# EasyEDA Pro project ProPrj_PCB_2025-05-19.epro, schematic Schematic3
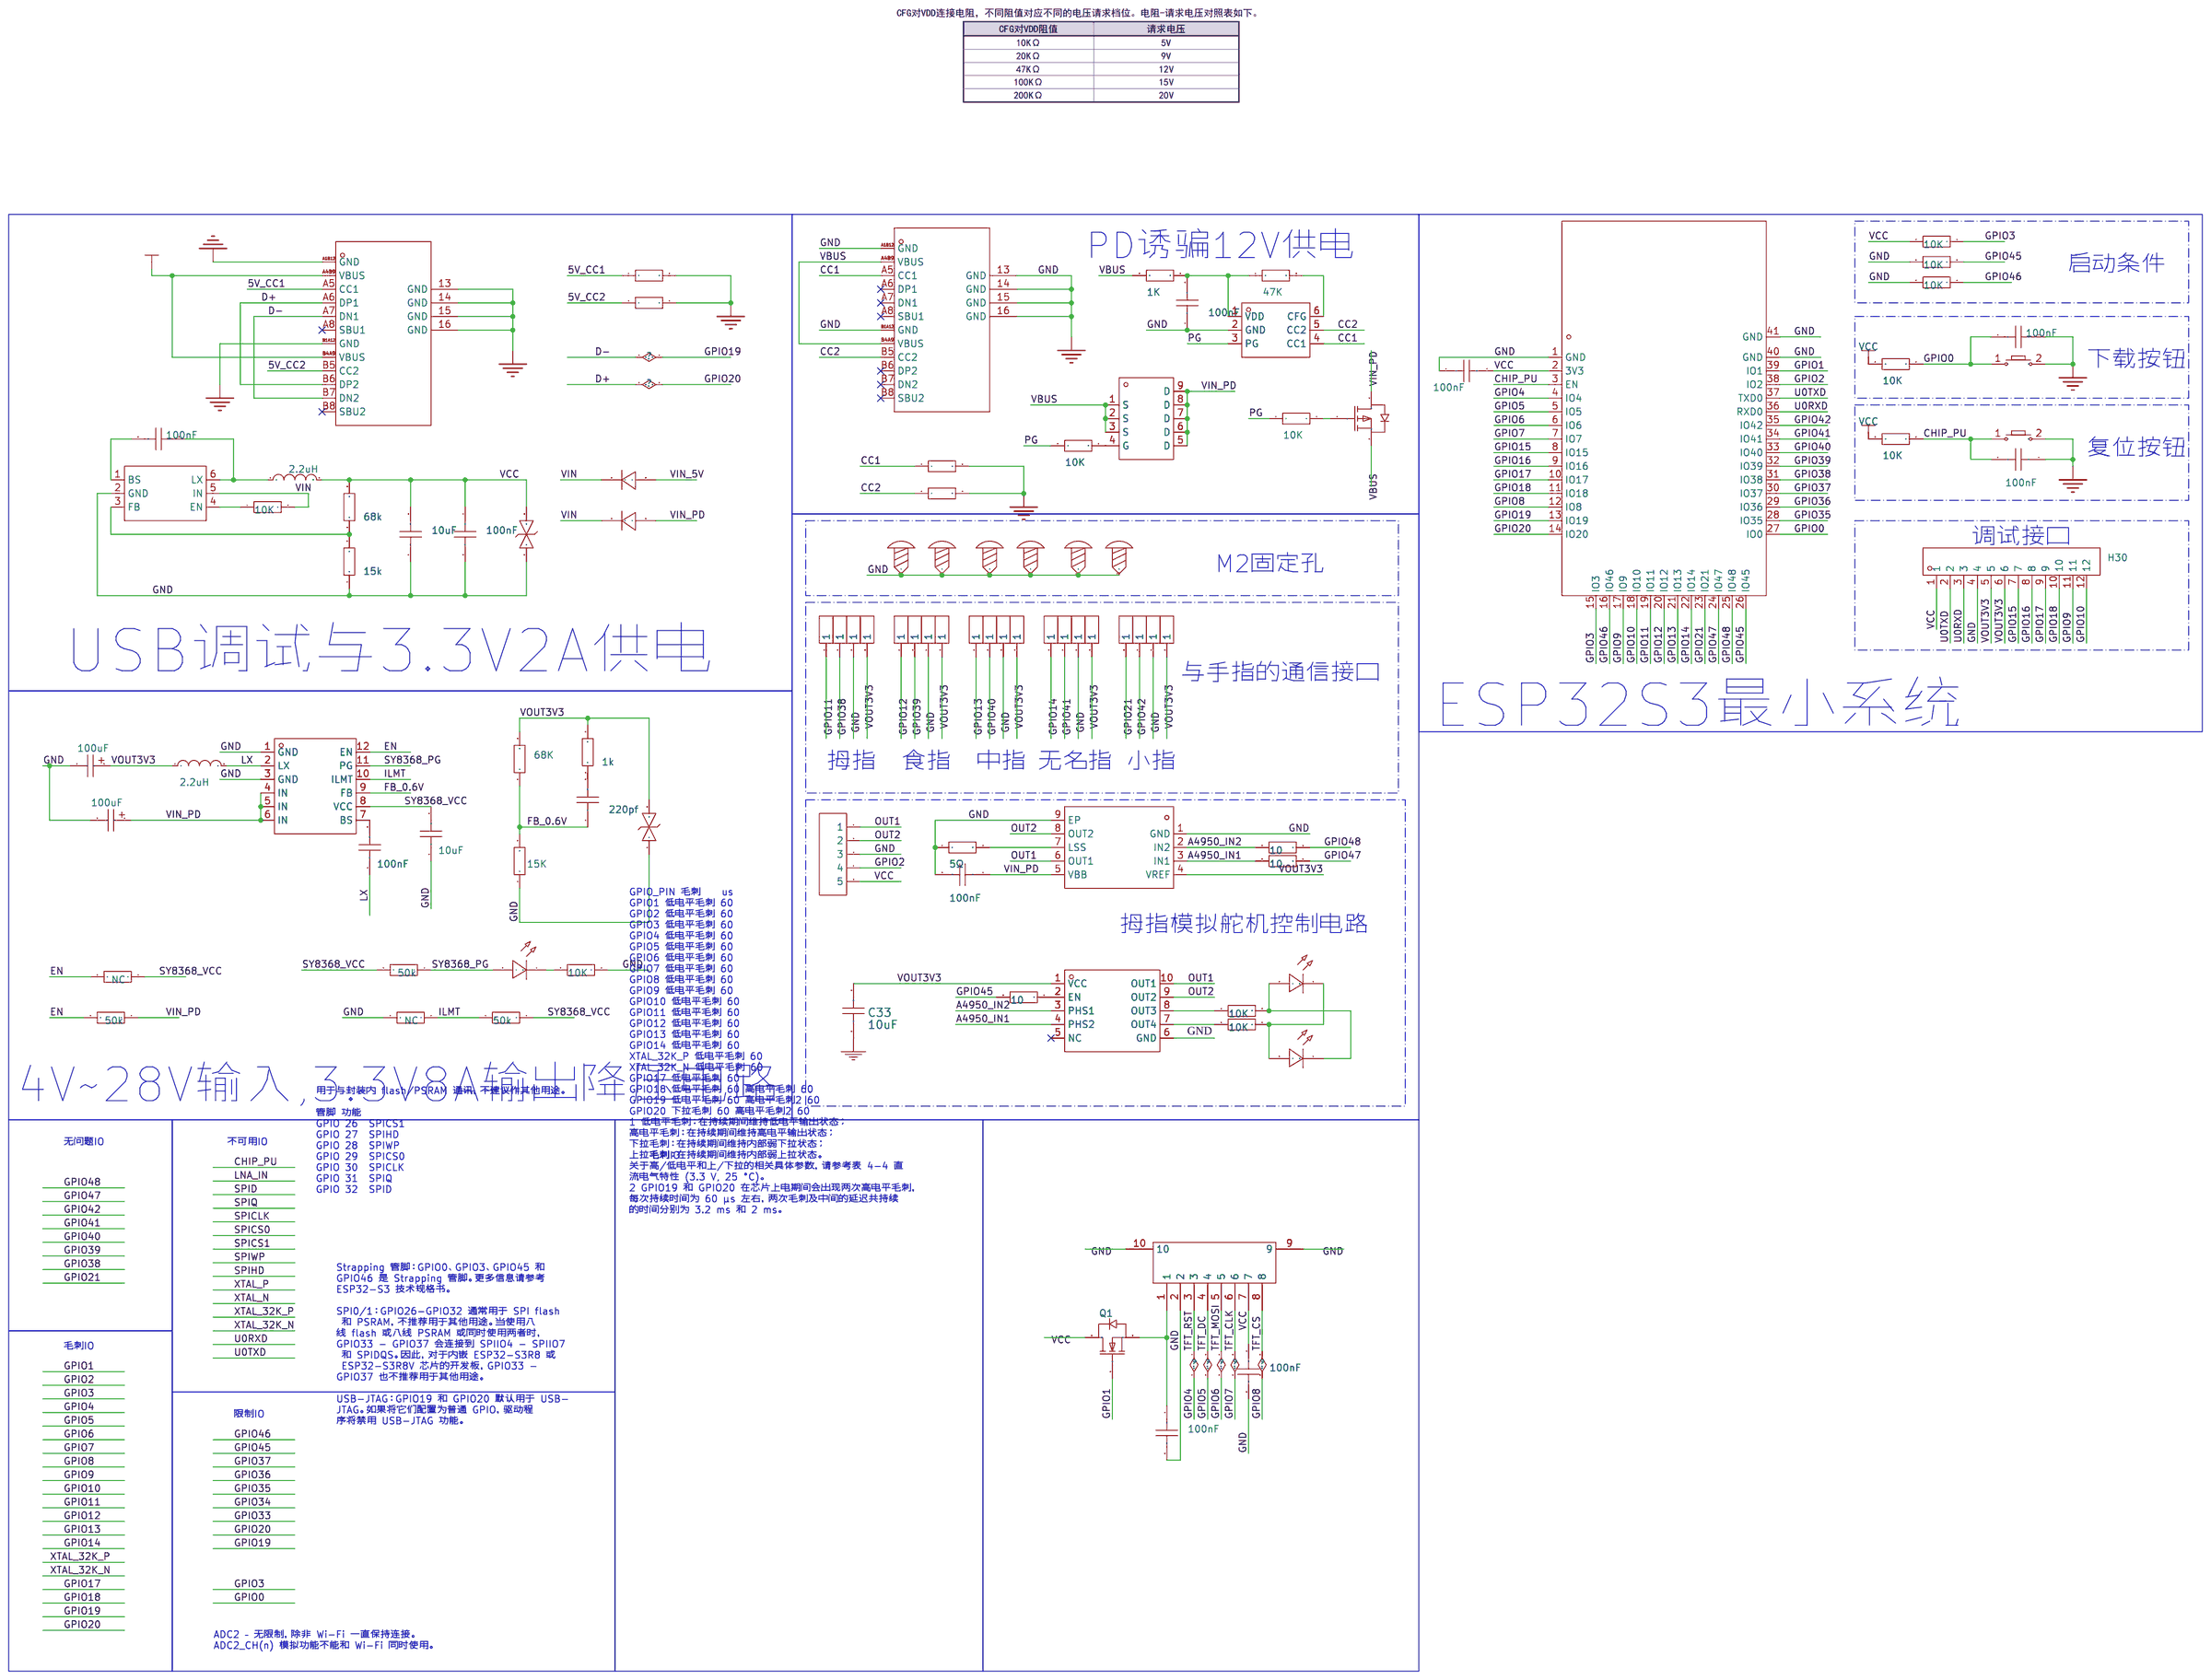
[diagram p1: schematic sheet]

## Parts
C1  100nF  [C0603]
C5  220pf  [C0603]
C6  100nF  [C0603]
C7  100nF  [C0603]
C9  100nF  [C0603]
C10  100nF  [C0603]
C11  100nF  [C0603]
C24  100nF  [C0603]
C25  100nF  [C0603]
C26  100nF  [C0603]
C27  10uF  [C0603]
C28  100nF  [C0603]
C29  10uF  [C0603]
C31  100uF  [CASE-B_3528]
C32  100uF  [CASE-B_3528]
C33  10uF  [C0603]
D1  SMBJ33CA  [SMB_L4.6-W3.6-LS5.4-BI]
D2  SMBJ33CA  [SMB_L4.6-W3.6-LS5.4-BI]
D3  S10MC  [SMC_L7.1-W6.2-LS8.1-RD]
D4  S10MC  [SMC_L7.1-W6.2-LS8.1-RD]
FPC1  AFC01-S08FCA-00  [FPC-SMD_P0.50-8P_FGS-XJ-H2.0]
H6  -  [HDR-TH_5P-P2.54-V-F]
H10  -  [HDR-TH_1P-V-M_XKB_X4611WV-01I-C28D40]
H11  -  [HDR-TH_1P-V-M_XKB_X4611WV-01I-C28D40]
H12  -  [HDR-TH_1P-V-M_XKB_X4611WV-01I-C28D40]
H13  -  [HDR-TH_1P-V-M_XKB_X4611WV-01I-C28D40]
H14  -  [HDR-TH_1P-V-M_XKB_X4611WV-01I-C28D40]
H15  -  [HDR-TH_1P-V-M_XKB_X4611WV-01I-C28D40]
H16  -  [HDR-TH_1P-V-M_XKB_X4611WV-01I-C28D40]
H17  -  [HDR-TH_1P-V-M_XKB_X4611WV-01I-C28D40]
H18  -  [HDR-TH_1P-V-M_XKB_X4611WV-01I-C28D40]
H19  -  [HDR-TH_1P-V-M_XKB_X4611WV-01I-C28D40]
H20  -  [HDR-TH_1P-V-M_XKB_X4611WV-01I-C28D40]
H21  -  [HDR-TH_1P-V-M_XKB_X4611WV-01I-C28D40]
H22  -  [HDR-TH_1P-V-M_XKB_X4611WV-01I-C28D40]
H23  -  [HDR-TH_1P-V-M_XKB_X4611WV-01I-C28D40]
H24  -  [HDR-TH_1P-V-M_XKB_X4611WV-01I-C28D40]
H25  -  [HDR-TH_1P-V-M_XKB_X4611WV-01I-C28D40]
H26  -  [HDR-TH_1P-V-M_XKB_X4611WV-01I-C28D40]
H27  -  [HDR-TH_1P-V-M_XKB_X4611WV-01I-C28D40]
H28  -  [HDR-TH_1P-V-M_XKB_X4611WV-01I-C28D40]
H29  -  [HDR-TH_1P-V-M_XKB_X4611WV-01I-C28D40]
H30  -  [HDR-TH_12P-P2.54-V-F]
L1  2.2uH  [IND-SMD_L11.0-W10.0]
L2  2.2uH  [IND-SMD_L2.5-W2.0-B]
LED1  -  [LED_0603]
LED2  -  [LED_0603]
LED3  -  [LED_0603]
Q1  AO3400A  [SOT-23-3_L2.9-W1.3-P1.90-LS2.4-BR]
Q2  AO3401A  [SOT-23_L2.9-W1.3-P1.90-LS2.4-BR]
Q3  NCE40P20Q  [DFN-8_L3.0-W3.0-P0.65-BL-4]
R1  68K  [R0603]
R2  15K  [R0603]
R3  1k  [R0603]
R4  50k  [R0603]
R5  10K  [R0603]
R6  NC  [R0603]
R7  50k  [R0603]
R8  NC  [R0603]
R11  0402WGF5101TCE  [R0603]
R13  0402WGF5101TCE  [R0603]
R45  10K  [R0603]
R49  10K  [R0603]
R50  10K  [R0603]
R51  10K  [R0603]
R55  47K  [R0805]
R68  10  [R0805]
R69  10  [R0805]
R70  5Ω  [R0805]
R71  10K  [R0603]
R77  68k  [R0603]
R78  15k  [R0603]
R94  1K  [R0805]
R95  10K  [R0603]
R96  10K  [R0603]
R97  50k  [R0603]
R98  10K  [R0603]
R99  0402WGF5101TCE  [R0603]
R100  0402WGF5101TCE  [R0603]
R103  10  [R0805]
R104  10K  [R0603]
R105  10K  [R0603]
SW1  -  [Key_SMD_3x4x2]
SW2  -  [Key_SMD_3x4x2]
TP1  -  [M2螺丝]
TP2  -  [M2螺丝]
TP3  -  [M2螺丝]
TP4  -  [M2螺丝]
TP7  -  [M2螺丝]
TP9  -  [M2螺丝]
U1  SY8368AQQC  [QFN-12_L3.0-W3.0-P0.45-TL-EP]
U2  ESP32-S3-WROOM-1-N16R8  [esp32s3-woom-1]
U33  A4950ELJTR-T  [SOIC-8_L4.9-W3.9-P1.27-LS6.0-BL-EP]
U40  CH221K  [SOT-23-6_L2.9-W1.6-P0.95-LS2.9-BL]
U41  SY8253ADC  [SOT-23-6_L2.9-W1.6-P0.95-LS2.8-BR]
U42  AT8549  [SSOP-10_L4.9-W3.9-P1.00-LS6.0-BL]
USB1  -  [USB-C-SMD_TYPEC-304-BCP16]
USB2  -  [USB-C-SMD_TYPEC-304-BCP16]

## Library data of the parts
C1 C5-C7 C9-C11 C24-C29 = CAP_0603: Supplier Footprint: 0603
C31 C32 = TAJB107K006RNJ: 容值:100uF;精度:±10%;额定电压:6.3V;等效串联电阻:1.7Ω@100kHz;; LCSC Part Name: 100uF ±10% 6.3V; Supplier Part: C16133; Manufacturer: Kyocera AVX; Supplier Footprint: CASE-B-3528-21(mm); JLCPCB Part Class: 基础库; Datasheet: https://atta.szlcsc.com/upload/public/pdf/source/20160107/1457707750344.pdf; Supplier: LCSC; Tolerance: ±10%; Rated Voltage: 6.3V; Equivalent Series Resistance(ESR): 1.7Ω@100kHz; Operating Temperature: -55℃~+125℃
C33 = 100nF: link: https://item.szlcsc.com/362304.html; 3DModel: C0603_L1.6-W0.8-H0.8; Supplier: LCSC; Manufacturer: YAGEO; Manufacturer Part: CC0603KRX7R9BB104; Supplier Part: C14663; JLCPCB Part Class: Basic; JLCPCB SMD: Yes
D1 D2 = SMBJ33CA_C19077587: 极性:双向;反向截止电压(Vrwm):33V;钳位电压:53.3V;峰值脉冲电流(Ipp):11.26A;峰值脉冲功率(Ppp):600W;击穿电压:36.7V;; Supplier Part: C19077587; Manufacturer: 宏嘉诚; Supplier Footprint: SMB; JLCPCB Part Class: 扩展库; Datasheet: https://atta.szlcsc.com/upload/public/pdf/source/20250107/474F05451FC8AB27D7FA0238914F96F6.pdf; Supplier: LCSC; Polarity: 双向; Reverse Stand-Off Voltage (Vrwm): 33V; Clamping Voltage: 53.3V; Peak Pulse Current (Ipp): 11.26A; Peak Pulse Power Dissipation (Ppp): 600W; Voltage - Breakdown: 36.7V; Reverse Leakage Current (Ir): 5uA; Number of Channels: 单路; Type: TVS
D3 D4 = S10MC: 二极管配置:独立式;正向压降(Vf):1V@10A;直流反向耐压(Vr):1kV;整流电流:10A;; LCSC Part Name: 电压:1kV 电流:10A; Supplier Part: C64933; Manufacturer: MDD(辰达半导体); Supplier Footprint: SMC(DO-214AB); JLCPCB Part Class: 扩展库; Datasheet: https://atta.szlcsc.com/upload/public/pdf/source/20230314/1A4EE04768B6F73C910BD0715A0F0DB0.pdf; Supplier: LCSC; Diode Configuration: 独立式; Forward Voltage (Vf@If): 1V@10A; Reverse Voltage (Vr): 1kV; Rectified Current: 10A; Reverse Leakage Current: 5uA@1kV
FPC1 = AFC01-S08FCA-00: 锁定特性:翻盖式;触点类型:下接;触点数量:8P;间距:0.5mm;安装类型:卧贴;; LCSC Part Name: 间距:0.5mm P数:8P 翻盖式 下接; Supplier Part: C262657; Manufacturer: JS(钜硕电子); Supplier Footprint: SMD,P=0.5mm,卧贴; JLCPCB Part Class: 扩展库; Datasheet: https://atta.szlcsc.com/upload/public/pdf/source/20190816/C413942_2A72D1AC756EAE17EEDF756A339D4500.pdf; Supplier: LCSC; Locking Feature: 翻盖式; Contact Type: 下接; Number of Contacts: 8P; Pitch: 0.5mm; Mounting Type: 卧贴; FFC, FCB Thickness: 0.3mm; Height Above Board: 2mm
H6 = HDR-F_2.54_1x5P: Supplier Part: C50950; Supplier Footprint: 插件
H10-H29 = HDR-M_2.54_1x1P: Supplier Part: C81276; Supplier Footprint: 插件; JLCPCB Part Class: Extended Part
H30 = HDR-F_2.54_1x12P: Supplier Part: C2905419; Supplier Footprint: 插件
L1 = CXP1050-2R2M-AG(2.2uh): 电感值:2.2uH;精度:±20%;额定电流:13A;饱和电流(Isat):20A;类型:一体成型电感;; LCSC Part Name: 2.2uH ±20% 20A; Supplier Part: C7461387; Manufacturer: DMBJ(振宝佳); Supplier Footprint: 1050; JLCPCB Part Class: 扩展库; Datasheet: https://atta.szlcsc.com/upload/public/pdf/source/20230706/7F3A5B39C5AD80A91C9FA782B54A296B.pdf; Supplier: LCSC; Tolerance: ±20%; Current Rating: 13A; Current - Saturation(Isat): 20A; DC Resistance(DCR): 6.5mΩ; Type: 一体成型电感
L2 = PIM252010-1R0MTS00: 电感值:1.0uH精度:±20%额定电流:4.1A直流电阻(DCR):30mΩ; Supplier Part: C2986790; Manufacturer: FH(风华); Supplier Footprint: SMD,2.5x2x1mm; JLCPCB Part Class: Extended Part; Datasheet: https://atta.szlcsc.com/upload/public/pdf/source/20220412/F9C223B3E3BB425973BA14529C55B246.pdf; Supplier: LCSC
LED1-LED3 = LED_0603-R: Supplier Footprint: 0603
Q1 = AO3400A_C20917: 类型:1个N沟道;漏源电压(Vdss):30V;连续漏极电流(Id):5.7A;导通电阻(RDS(on)@Vgs,Id):26.5mΩ@10V,5.7A;功率(Pd):1.4W;阈值电压(Vgs(th)@Id):1.5V@250uA;; LCSC Part Name: 1个N沟道 耐压:30V 电流:5.7A; Supplier Part: C20917; Manufacturer: AOS; Supplier Footprint: SOT-23-3L; JLCPCB Part Class: 基础库; Datasheet: https://atta.szlcsc.com/upload/public/pdf/source/20140107/1457706668533.pdf; Supplier: LCSC; Type: 1个N沟道; Drain Source Voltage (Vdss): 30V; Continuous Drain Current (Id): 5.7A; Drain Source On Resistance (RDS(on)@Vgs,Id): 26.5mΩ@10V,5.7A; Power Dissipation (Pd): 1.4W; Gate Threshold Voltage (Vgs(th)@Id): 1.5V@250uA; Total Gate Charge (Qg@Vgs): 7nC@4.5V; Input Capacitance (Ciss@Vds): 630pF@15V; Operating Temperature: -55℃~+150℃@(Tj)
Q2 = AO3401A_C15127: 类型:1个P沟道;漏源电压(Vdss):30V;连续漏极电流(Id):4A;导通电阻(RDS(on)@Vgs,Id):44mΩ@10V,4.3A;功率(Pd):1.4W;阈值电压(Vgs(th)@Id):1.3V@250uA;; LCSC Part Name: 1个P沟道 耐压:30V 电流:4A; Supplier Part: C15127; Manufacturer: AOS; Supplier Footprint: SOT-23; JLCPCB Part Class: 基础库; Datasheet: https://atta.szlcsc.com/upload/public/pdf/source/20160507/1462613609053.pdf; Supplier: LCSC; Type: 1个P沟道; Drain Source Voltage (Vdss): 30V; Continuous Drain Current (Id): 4A; Drain Source On Resistance (RDS(on)@Vgs,Id): 44mΩ@10V,4.3A; Power Dissipation (Pd): 1.4W; Gate Threshold Voltage (Vgs(th)@Id): 1.3V@250uA; Total Gate Charge (Qg@Vgs): 12.2nC@4.5V; Input Capacitance (Ciss@Vds): 1.2nF@15V; Operating Temperature: -55℃~+150℃@(Tj)
Q3 = NCE40P20Q: 类型:1个P沟道;漏源电压(Vdss):40V;功率(Pd):30W;阈值电压(Vgs(th)@Id):-;; LCSC Part Name: 1个P沟道 耐压:40V; Supplier Part: C2686564; Manufacturer: NCE(无锡新洁能); Supplier Footprint: DFN-8L(3.3x3.3); JLCPCB Part Class: 扩展库; Datasheet: https://atta.szlcsc.com/upload/public/pdf/source/20220809/AB5FD42DF7A81DEF3599B79A1C45926F.pdf; Supplier: LCSC; Type: 1个P沟道; Drain Source Voltage (Vdss): 40V; Power Dissipation (Pd): 30W; Operating Temperature: -55℃~+150℃
R1-R8 R45 R49-R51 R71 R77 R78 R95-R98 R104 R105 = Res_0603: Supplier Footprint: 0603
R11 R13 R99 R100 = 0402WGF5101TCE: LCSC Part Name: 5.1KΩ(5101) ±1% 编带; Supplier Part: C25905; Manufacturer: UNI-ROYAL(厚声); Supplier Footprint: 0402; JLCPCB Part Class: Basic Part; Datasheet: https://atta.szlcsc.com/upload/public/pdf/source/20170920/C25905_1505895107382980911.pdf; Supplier: LCSC
R55 R68-R70 R94 R103 = Res_0805: Supplier Footprint: 0805
SW1 SW2 = Key_SMD_3x4x2: Supplier Footprint: SMD
TP1-TP4 TP7 TP9 = M2螺丝: Supplier Footprint: 插件
U1 = SY8368AQQC: 功能类型:降压型;输出类型:固定;工作电压:4V~28V;输出电压:5V;输出电流:8A;; LCSC Part Name: 高效快速响应8A连续16A峰值28V输入同步降压调节器; Supplier Part: C207642; Manufacturer: silergy(矽力杰); Supplier Footprint: QFN-12(3x3); JLCPCB Part Class: 扩展库; Datasheet: https://atta.szlcsc.com/upload/public/pdf/source/20230216/4232C0095630C5F8359F22493EDE685C.pdf; Supplier: LCSC; Function: 降压型; Output Type: 固定; Input Voltage: 4V~28V; Output Voltage: 5V; Output Current: 8A; Switching Frequency: 800kHz; Operating Temperature: -40℃~+125℃@(TJ); Synchronous Rectification: 是; Number of Outputs: 1; Topology: 降压式; Quiescent Current (Iq): 100uA; Switch tube (built-in/external): 内置
U2 = ESP32-S3-WROOM-1-N16R8: LCSC Part Name: 通用型Wi-Fi+低功耗蓝牙MCU模组; Supplier Part: C2913202; Manufacturer: ESPRESSIF(乐鑫); Supplier Footprint: SMD,18x25.5mm; JLCPCB Part Class: 扩展库; Datasheet: https://atta.szlcsc.com/upload/public/pdf/source/20220705/4E799F39581577F766659887F738A439.pdf; Supplier: LCSC
U33 = A4950ELJTR-T: 全桥DMOS PWM电机驱动器; Supplier Part: C82404; Manufacturer: ALLEGRO(美国埃戈罗); Supplier Footprint: SOIC-8-EP; JLCPCB Part Class: 扩展库; Datasheet: https://atta.szlcsc.com/upload/public/pdf/source/20161024/1477288450284.pdf; Supplier: LCSC
U40 = CH221K_C9900089059: Supplier Part: C9900089059; Supplier Footprint: SOT-23-6; JLCPCB Part Class: 扩展库; Supplier: LCSC
U41 = SY8253ADC: 功能类型:降压型;输出类型:-;工作电压:4.5V~23V;输出电压:3.3V;输出电流:3A;; LCSC Part Name: 高效500kHz 3A同步降压DC-DC转换器; Supplier Part: C93736; Manufacturer: silergy(矽力杰); Supplier Footprint: SOT-23-6; JLCPCB Part Class: 扩展库; Datasheet: https://atta.szlcsc.com/upload/public/pdf/source/20180625/C93736_E75EC6FD4320D65590D2D5BF0D8B8959.pdf; Supplier: LCSC; Function: 降压型; Voltage - Supply: 4.5V~23V; Output Voltage: 3.3V; Output Current: 3A; Frequency - Switching: 500kHz; Operating Temperature: -40℃~+125℃; Synchronous Rectifier: 是; Number of Outputs: 1; Topology: 降压式; Switch tube (built-in/external): 内置
U42 = AT8549: Supplier Part: C2901460; Manufacturer: 杭州中科微; Supplier Footprint: SSOP-10-150mil; JLCPCB Part Class: 扩展库; Datasheet: https://atta.szlcsc.com/upload/public/pdf/source/20210922/7D297391A106973500C7B01D506ACF09.pdf; Supplier: LCSC
USB1 USB2 = typec-304-bcp16: 连接器类型:Type-C;标准:USB 3.1;公母:母座;触点数量:16.0;端口数量:1;安装方式:卧贴;额定电流 - 电源:3A;工作温度范围:-25~+85;焊接温度(最大值):260;; LCSC Part Name: TYPEC-304-BCP16; Supplier Part: C720629; Manufacturer: XUNPU(讯普); Manufacturer Part: TYPEC-304-BCP16; Supplier Footprint: SMD; JLCPCB Part Class: Extended Part; Datasheet: https://atta.szlcsc.com/upload/public/pdf/source/20211022/DACD6552F639E9483017DE6DC0E61150.pdf; Supplier: LCSC; Connector Type: Type-C; Standard: USB 3.1; Gender: 母座; Number of Contacts: 16.0; Number of Ports: 1; Mounting Sytle: 卧贴; Current Rating - Power (Max): 3A; Operating Temperature Range: -25~+85; Welding Temperature (Max): 260

## Nets
5V_CC1: R11.1 USB1.A5(CC1)
5V_CC2: R13.1 USB1.B5(CC2)
GND: C1.1 C7.2 C9.1 C10.1 C11.1 C24.2 C25.2 C27.2 C28.2 C29.1 C31.2 C32.2 C33.1 D1.1 D2.1 FPC1.2 FPC1.9 FPC1.10 H6.3 H11.1 H15.1 H19.1 H23.1 H27.1 H30.4 R2.1 R5.1 R8.2 R11.2 R13.2 R45.2 R49.2 R70.1 R78.1 R99.2 R100.2 SW1.2 SW2.2 TP1.1 TP2.1 TP3.1 TP4.1 TP7.1 TP9.1 U1.1(GND) U1.3(GND) U2.1(GND) U2.40(GND) U2.41(GND) U33.1(GND) U33.9(EP) U40.2(GND) U41.2(GND) U42.6(GND) USB1.13(GND) USB1.14(GND) USB1.15(GND) USB1.16(GND) USB1.A1B12(GND) USB1.B1A12(GND) USB2.13(GND) USB2.14(GND) USB2.15(GND) USB2.16(GND) USB2.A1B12(GND) USB2.B1A12(GND)
VBUS: Q2.2(S) Q3.1(S) Q3.2(S) Q3.3(S) R94.2 USB2.A4B9(VBUS) USB2.B4A9(VBUS)
VCC: C9.2 C25.1 C27.1 C28.1 D1.2 FPC1.7 H6.5 H30.1 L2.2 Q1.3(D) R50.2 R51.2 R71.2 R77.2 U2.2(3V3)
VIN: D3.1(K) D4.1(K) R96.2 U41.5(IN)
VIN_5V: D4.2(A) USB1.A4B9(VBUS) USB1.B4A9(VBUS)
VIN_PD: C7.1 C32.1 D3.2(A) Q2.3(D) Q3.5(D) Q3.6(D) Q3.7(D) Q3.8(D) Q3.9(D) R4.1 U1.4(IN) U1.5(IN) U1.6(IN) U33.5(VBB)
A4950_IN1: R68.1 U33.3(IN1) U42.4(PHS2)
A4950_IN2: R69.1 U33.2(IN2) U42.3(PHS1)
CC1: R99.1 U40.4(CC1) USB2.A5(CC1)
CC2: R100.1 U40.5(CC2) USB2.B5(CC2)
CHIP_PU: C11.2 R50.1 SW1.1 U2.3(EN)
D+: U2.14(IO20) USB1.A6(DP1) USB1.B6(DP2)
D-: U2.13(IO19) USB1.A7(DN1) USB1.B7(DN2)
EN: R4.2 R6.2 U1.12(EN)
FB_0.6V: C5.1 R1.1 R2.2 U1.9(FB)
GPIO0: C10.2 R51.1 SW2.1 U2.27(IO0)
GPIO1: Q1.1(G) U2.39(IO1)
GPIO2: H6.4 U2.38(IO2)
GPIO3: R71.1 U2.15(IO3)
GPIO4: FPC1.3 U2.4(IO4)
GPIO5: FPC1.4 U2.5(IO5)
GPIO6: FPC1.5 U2.6(IO6)
GPIO7: FPC1.6 U2.7(IO7)
GPIO8: FPC1.8 U2.12(IO8)
GPIO9: H30.11 U2.17(IO9)
GPIO10: H30.12 U2.18(IO10)
GPIO11: H29.1 U2.19(IO11)
GPIO12: H25.1 U2.20(IO12)
GPIO13: H21.1 U2.21(IO13)
GPIO14: H17.1 U2.22(IO14)
GPIO15: H30.7 U2.8(IO15)
GPIO16: H30.8 U2.9(IO16)
GPIO17: H30.9 U2.10(IO17)
GPIO18: H30.10 U2.11(IO18)
GPIO21: H13.1 U2.23(IO21)
GPIO35: U2.28(IO35)
GPIO36: U2.29(IO36)
GPIO37: U2.30(IO37)
GPIO38: H28.1 U2.31(IO38)
GPIO39: H24.1 U2.32(IO39)
GPIO40: H20.1 U2.33(IO40)
GPIO41: H16.1 U2.34(IO41)
GPIO42: H12.1 U2.35(IO42)
GPIO45: R45.1 R103.1 U2.26(IO45)
GPIO46: R49.1 U2.16(IO46)
GPIO47: R68.2 U2.24(IO47)
GPIO48: R69.2 U2.25(IO48)
ILMT: R7.2 R8.1 U1.10(ILMT)
LX: C6.1 L1.2 U1.2(LX)
OUT1: H6.1 U33.6(OUT1) U42.10(OUT1)
OUT2: H6.2 U33.8(OUT2) U42.9(OUT2)
PG: R95.2 R98.1 U40.3(PG)
SY8368_PG: LED1.2(A) R97.1 U1.11(PG)
SY8368_VCC: C29.2 R6.1 R7.1 R97.2 U1.8(VCC)
U0RXD: H30.3 U2.36(RXD0)
U0TXD: H30.2 U2.37(TXD0)
VOUT3V3: C31.1 C33.2 D2.2 H10.1 H14.1 H18.1 H22.1 H26.1 H30.5 H30.6 L1.1 R1.2 R3.2 U33.4(VREF) U42.1(VCC)
$1N4191: C1.2 R55.1 R94.1 U40.1(VDD)
$1N4196: R55.2 U40.6(CFG)
$1N5339: R70.2 U33.7(LSS)
$1N6297: C24.1 FPC1.1 Q1.2(S)
$1N11366: C26.1 U41.1(BS)
$1N11371: C26.2 L2.1 U41.6(LX)
$1N11492: R77.1 R78.2 U41.3(FB)
$1N14990: Q2.1(G) R95.1
$1N15210: R96.1 U41.4(EN)
$1N15667: C5.2 R3.1
$1N15674: C6.2 U1.7(BS)
$1N15711: LED1.1(C) R5.2
$1N16104: Q3.4(G) R98.2
$1N18690: R104.1 U42.8(OUT3)
$1N18692: R105.1 U42.7(OUT4)
$1N18776: LED2.2(A) LED3.1(C) R104.2
$1N18803: LED2.1(C) LED3.2(A) R105.2
$1N18934: R103.2 U42.2(EN)

Not connected (* = marked no-connect by the designer): U42 5(NC)*; USB1 A8(SBU1)* B8(SBU2)*; USB2 A6(DP1)* A7(DN1)* A8(SBU1)* B6(DP2)* B7(DN2)* B8(SBU2)*

## Notes on the sheet
- PD诱骗12V供电
- 启动条件
- 下载按钮
- 复位按钮
- 调试接口
- M2固定孔
- USB调试与3.3V2A供电
- 与手指的通信接口
- ESP32S3最小系统
- 拇指
- 食指
- 中指
- 无名指
- 小指
- 拇指模拟舵机控制电路
- 4V~28V输入,3.3V8A输出降压电路
- 无问题IO
- 不可用IO
- 毛刺IO
- 用于与封装内 flash/PSRAM 通讯，不建议作其他用途。
  管脚	功能
  GPIO 26	SPICS1
  GPIO 27	SPIHD
  GPIO 28	SPIWP
  GPIO 29	SPICS0
  GPIO 30	SPICLK
  GPIO 31	SPIQ
  GPIO 32	SPID
- GPIO_PIN 毛刺    us
  GPIO1 低电平毛刺 60
  GPIO2 低电平毛刺 60
  GPIO3 低电平毛刺 60
  GPIO4 低电平毛刺 60
  GPIO5 低电平毛刺 60
  GPIO6 低电平毛刺 60
  GPIO7 低电平毛刺 60
  GPIO8 低电平毛刺 60
  GPIO9 低电平毛刺 60
  GPIO10 低电平毛刺 60
  GPIO11 低电平毛刺 60
  GPIO12 低电平毛刺 60
  GPIO13 低电平毛刺 60
  GPIO14 低电平毛刺 60
  XTAL_32K_P 低电平毛刺 60
  XTAL_32K_N 低电平毛刺 60
  GPIO17 低电平毛刺 60
  GPIO18 低电平毛刺 60 高电平毛刺 60
  GPIO19 低电平毛刺 60 高电平毛刺2 60
  GPIO20 下拉毛刺 60 高电平毛刺2 60
  1 低电平毛刺：在持续期间维持低电平输出状态；
  高电平毛刺：在持续期间维持高电平输出状态；
  下拉毛刺：在持续期间维持内部弱下拉状态；
  上拉毛刺：在持续期间维持内部弱上拉状态。
  关于高/低电平和上/下拉的相关具体参数，请参考表 4-4 直
  流电气特性 (3.3 V, 25 °C)。
  2 GPIO19 和 GPIO20 在芯片上电期间会出现两次高电平毛刺，
  每次持续时间为 60 µs 左右，两次毛刺及中间的延迟共持续
  的时间分别为 3.2 ms 和 2 ms。
- 毛刺IO
- 限制IO
- Strapping 管脚：GPIO0、GPIO3、GPIO45 和
  GPIO46 是 Strapping 管脚。更多信息请参考
  ESP32-S3 技术规格书。
  SPI0/1：GPIO26-GPIO32 通常用于 SPI flash
   和 PSRAM，不推荐用于其他用途。当使用八
  线 flash 或八线 PSRAM 或同时使用两者时，
  GPIO33 - GPIO37 会连接到 SPIIO4 - SPIIO7
   和 SPIDQS。因此，对于内嵌 ESP32-S3R8 或
   ESP32-S3R8V 芯片的开发板，GPIO33 -
  GPIO37 也不推荐用于其他用途。
  USB-JTAG：GPIO19 和 GPIO20 默认用于 USB-
  JTAG。如果将它们配置为普通 GPIO，驱动程
  序将禁用 USB-JTAG 功能。
- ADC2 – 无限制，除非 Wi-Fi 一直保持连接。
  ADC2_CH(n) 模拟功能不能和 Wi-Fi 同时使用。
